# Altium schematic sheet Digital Output.SchDoc
size A4
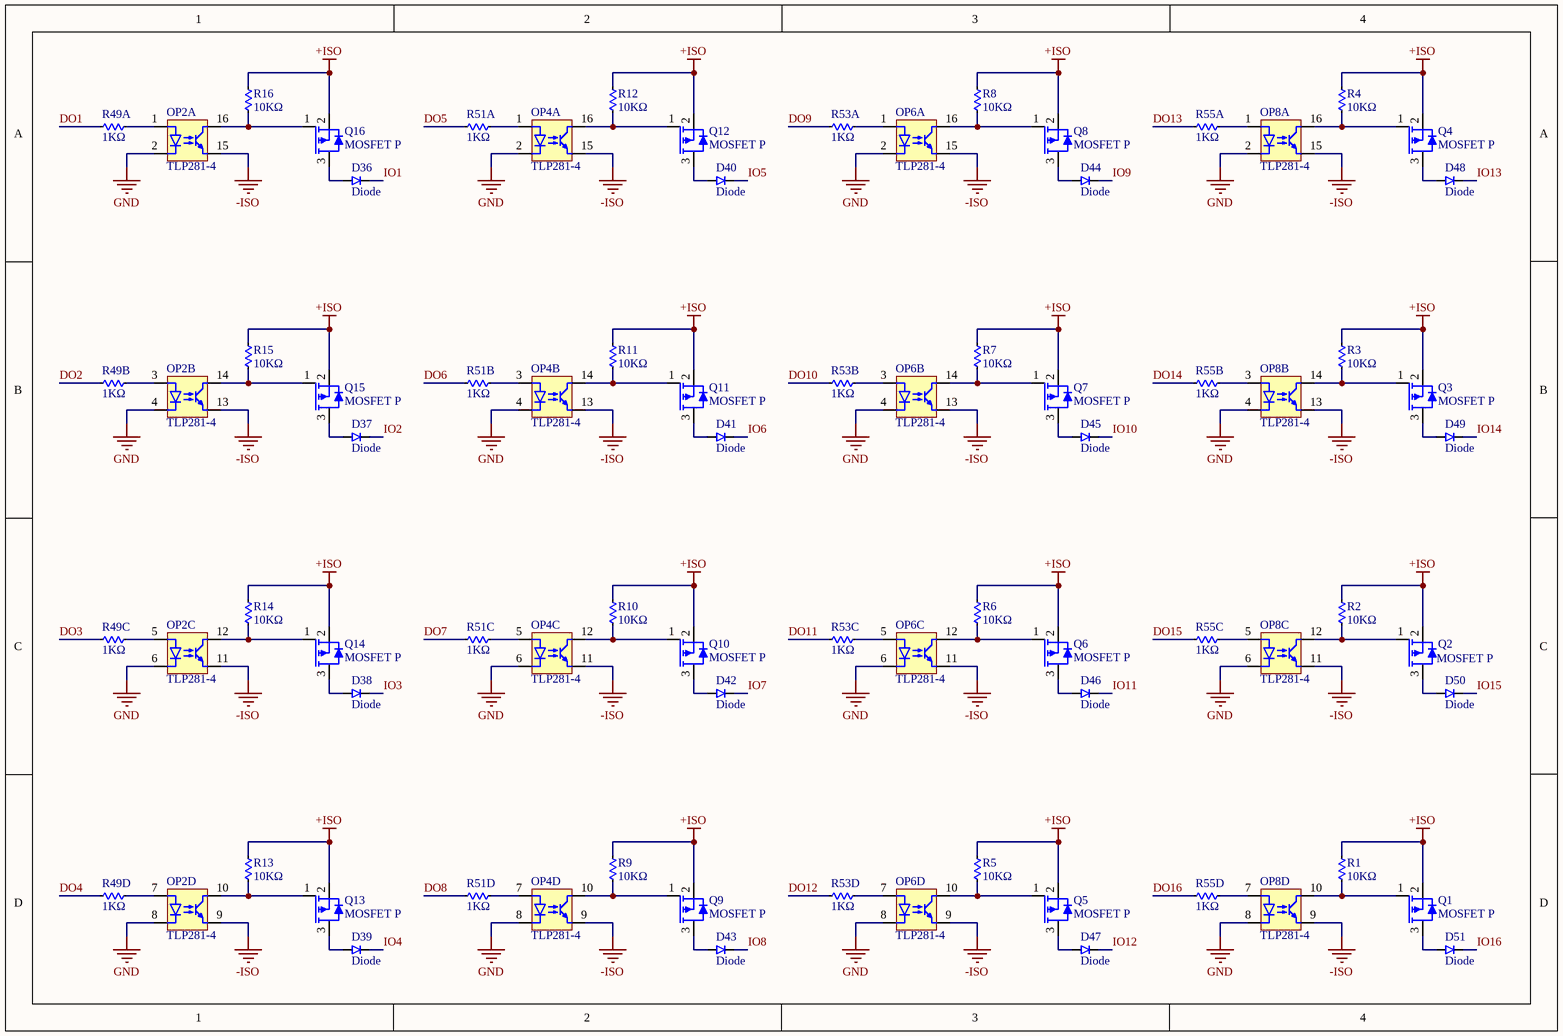
[diagram p0: Digital Output.SchDoc]

## Parts
D36  Diode  [DIOMELF3515L]
D37  Diode  [DIOMELF3515L]
D38  Diode  [DIOMELF3515L]
D39  Diode  [DIOMELF3515L]
D40  Diode  [DIOMELF3515L]
D41  Diode  [DIOMELF3515L]
D42  Diode  [DIOMELF3515L]
D43  Diode  [DIOMELF3515L]
D44  Diode  [DIOMELF3515L]
D45  Diode  [DIOMELF3515L]
D46  Diode  [DIOMELF3515L]
D47  Diode  [DIOMELF3515L]
D48  Diode  [DIOMELF3515L]
D49  Diode  [DIOMELF3515L]
D50  Diode  [DIOMELF3515L]
D51  Diode  [DIOMELF3515L]
OP2  TLP281-4  [SO16 TOSHIBA OPTOCOUPLER]  (parts A,B,C,D of 4)
OP4  TLP281-4  [SO16 TOSHIBA OPTOCOUPLER]  (parts A,B,C,D of 4)
OP6  TLP281-4  [SO16 TOSHIBA OPTOCOUPLER]  (parts A,B,C,D of 4)
OP8  TLP281-4  [SO16 TOSHIBA OPTOCOUPLER]  (parts A,B,C,D of 4)
Q1  MOSFET P  [SOT23]
Q2  MOSFET P  [SOT23]
Q3  MOSFET P  [SOT23]
Q4  MOSFET P  [SOT23]
Q5  MOSFET P  [SOT23]
Q6  MOSFET P  [SOT23]
Q7  MOSFET P  [SOT23]
Q8  MOSFET P  [SOT23]
Q9  MOSFET P  [SOT23]
Q10  MOSFET P  [SOT23]
Q11  MOSFET P  [SOT23]
Q12  MOSFET P  [SOT23]
Q13  MOSFET P  [SOT23]
Q14  MOSFET P  [SOT23]
Q15  MOSFET P  [SOT23]
Q16  MOSFET P  [SOT23]
R1  10KΩ  [RES 0603 10K]
R2  10KΩ  [RES 0603 10K]
R3  10KΩ  [RES 0603 10K]
R4  10KΩ  [RES 0603 10K]
R5  10KΩ  [RES 0603 10K]
R6  10KΩ  [RES 0603 10K]
R7  10KΩ  [RES 0603 10K]
R8  10KΩ  [RES 0603 10K]
R9  10KΩ  [RES 0603 10K]
R10  10KΩ  [RES 0603 10K]
R11  10KΩ  [RES 0603 10K]
R12  10KΩ  [RES 0603 10K]
R13  10KΩ  [RES 0603 10K]
R14  10KΩ  [RES 0603 10K]
R15  10KΩ  [RES 0603 10K]
R16  10KΩ  [RES 0603 10K]
R49  1KΩ  [RES ARRAY 4X0603 1K]  (parts A,B,C,D of 4)
R51  1KΩ  [RES ARRAY 4X0603 1K]  (parts A,B,C,D of 4)
R53  1KΩ  [RES ARRAY 4X0603 1K]  (parts A,B,C,D of 4)
R55  1KΩ  [RES ARRAY 4X0603 1K]  (parts A,B,C,D of 4)

## Nets
+ISO: Q1.2(S) Q2.2(S) Q3.2(S) Q4.2(S) Q5.2(S) Q6.2(S) Q7.2(S) Q8.2(S) Q9.2(S) Q10.2(S) Q11.2(S) Q12.2(S) Q13.2(S) Q14.2(S) Q15.2(S) Q16.2(S) R1.2 R2.2 R3.2 R4.2 R5.2 R6.2 R7.2 R8.2 R9.2 R10.2 R11.2 R12.2 R13.2 R14.2 R15.2 R16.2
-ISO: OP2.9 OP2.11 OP2.13 OP2.15 OP4.9 OP4.11 OP4.13 OP4.15 OP6.9 OP6.11 OP6.13 OP6.15 OP8.9 OP8.11 OP8.13 OP8.15
GND: OP2.2 OP2.4 OP2.6 OP2.8 OP4.2 OP4.4 OP4.6 OP4.8 OP6.2 OP6.4 OP6.6 OP6.8 OP8.2 OP8.4 OP8.6 OP8.8
DO1: R49.1
DO2: R49.2
DO3: R49.3
DO4: R49.4
DO5: R51.1
DO6: R51.2
DO7: R51.3
DO8: R51.4
DO9: R53.1
DO10: R53.2
DO11: R53.3
DO12: R53.4
DO13: R55.1
DO14: R55.2
DO15: R55.3
DO16: R55.4
IO1: D36.1
IO2: D37.1
IO3: D38.1
IO4: D39.1
IO5: D40.1
IO6: D41.1
IO7: D42.1
IO8: D43.1
IO9: D44.1
IO10: D45.1
IO11: D46.1
IO12: D47.1
IO13: D48.1
IO14: D49.1
IO15: D50.1
IO16: D51.1
NetD36_2: D36.2 Q16.3(D)
NetD37_2: D37.2 Q15.3(D)
NetD38_2: D38.2 Q14.3(D)
NetD39_2: D39.2 Q13.3(D)
NetD40_2: D40.2 Q12.3(D)
NetD41_2: D41.2 Q11.3(D)
NetD42_2: D42.2 Q10.3(D)
NetD43_2: D43.2 Q9.3(D)
NetD44_2: D44.2 Q8.3(D)
NetD45_2: D45.2 Q7.3(D)
NetD46_2: D46.2 Q6.3(D)
NetD47_2: D47.2 Q5.3(D)
NetD48_2: D48.2 Q4.3(D)
NetD49_2: D49.2 Q3.3(D)
NetD50_2: D50.2 Q2.3(D)
NetD51_2: D51.2 Q1.3(D)
NetOP2_1: OP2.1 R49.8
NetOP2_3: OP2.3 R49.7
NetOP2_5: OP2.5 R49.6
NetOP2_7: OP2.7 R49.5
NetOP2_10: OP2.10 Q13.1(G) R13.1
NetOP2_12: OP2.12 Q14.1(G) R14.1
NetOP2_14: OP2.14 Q15.1(G) R15.1
NetOP2_16: OP2.16 Q16.1(G) R16.1
NetOP4_1: OP4.1 R51.8
NetOP4_3: OP4.3 R51.7
NetOP4_5: OP4.5 R51.6
NetOP4_7: OP4.7 R51.5
NetOP4_10: OP4.10 Q9.1(G) R9.1
NetOP4_12: OP4.12 Q10.1(G) R10.1
NetOP4_14: OP4.14 Q11.1(G) R11.1
NetOP4_16: OP4.16 Q12.1(G) R12.1
NetOP6_1: OP6.1 R53.8
NetOP6_3: OP6.3 R53.7
NetOP6_5: OP6.5 R53.6
NetOP6_7: OP6.7 R53.5
NetOP6_10: OP6.10 Q5.1(G) R5.1
NetOP6_12: OP6.12 Q6.1(G) R6.1
NetOP6_14: OP6.14 Q7.1(G) R7.1
NetOP6_16: OP6.16 Q8.1(G) R8.1
NetOP8_1: OP8.1 R55.8
NetOP8_3: OP8.3 R55.7
NetOP8_5: OP8.5 R55.6
NetOP8_7: OP8.7 R55.5
NetOP8_10: OP8.10 Q1.1(G) R1.1
NetOP8_12: OP8.12 Q2.1(G) R2.1
NetOP8_14: OP8.14 Q3.1(G) R3.1
NetOP8_16: OP8.16 Q4.1(G) R4.1

## Library data of the parts
R1-R16 = RES 10K
R49 R51 R53 R55 = RES ARRAY 1K